# EasyEDA Pro project ESD_System.eprj, board PCB5
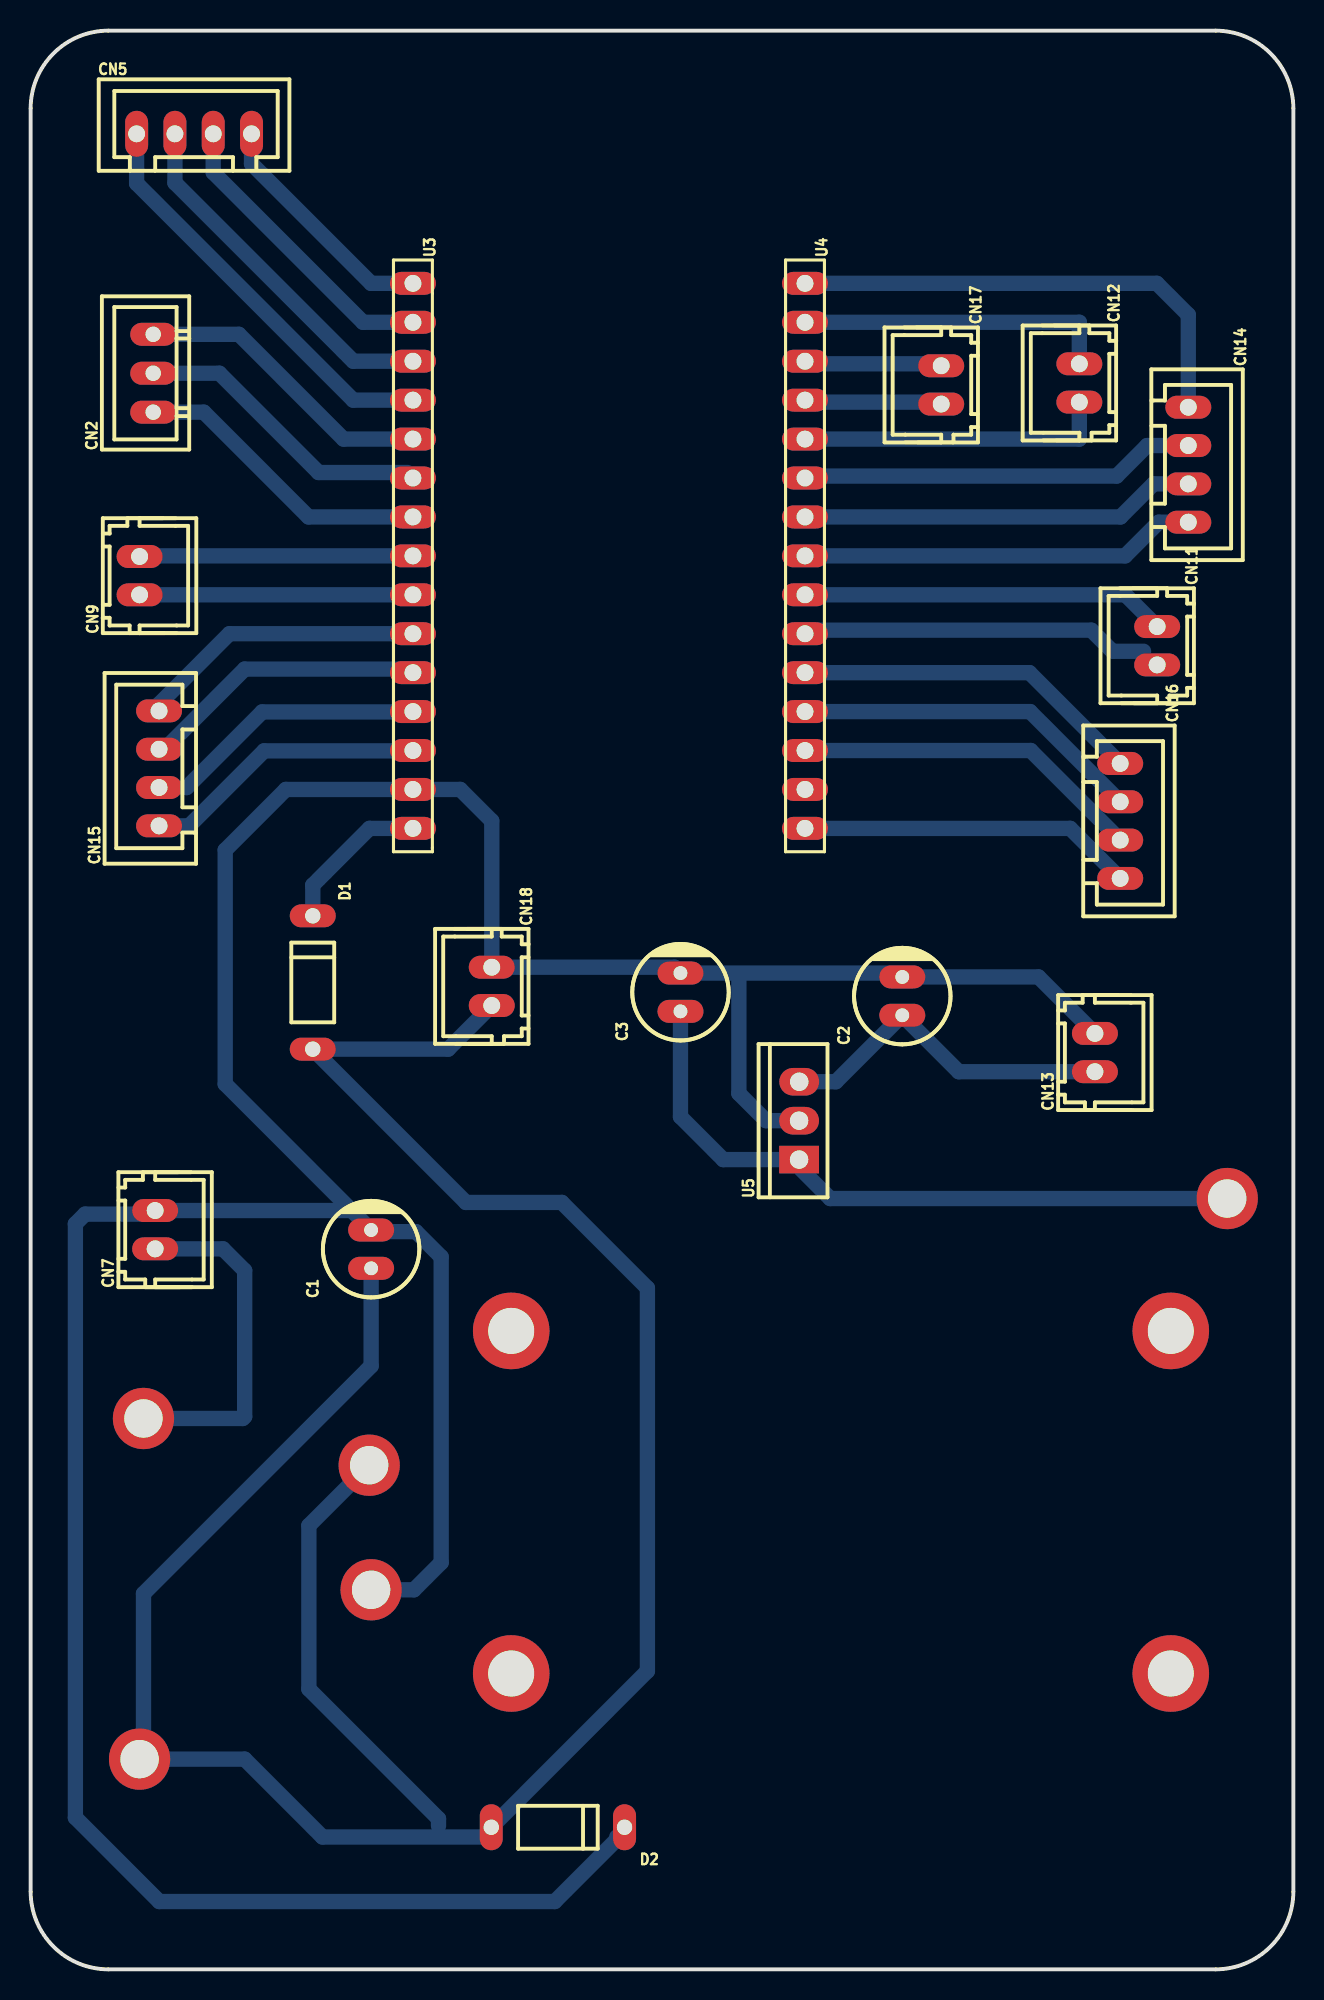
[diagram p4: board, top side]
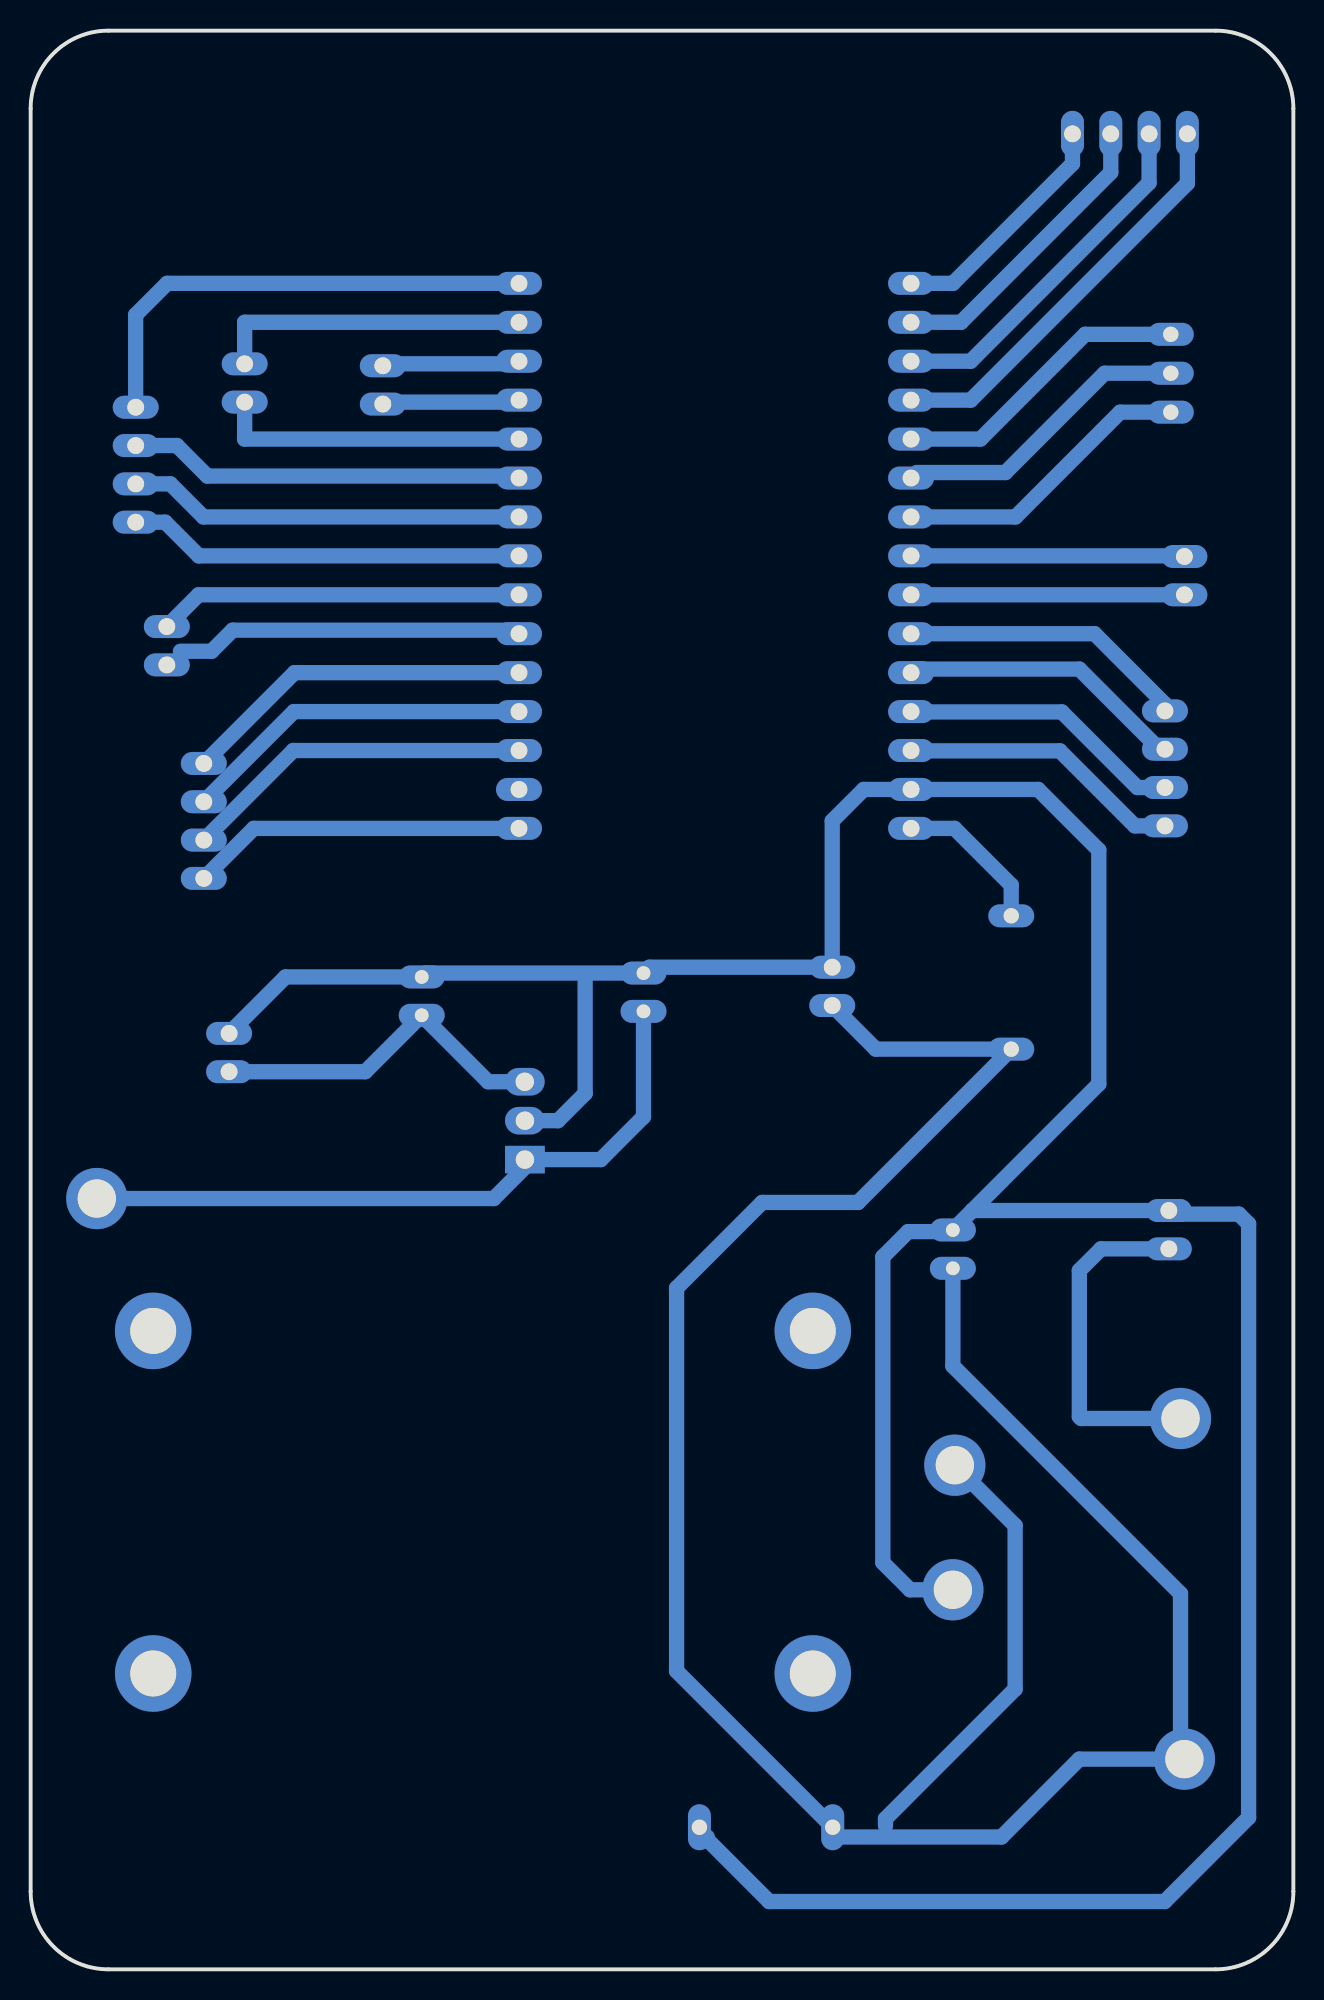
[diagram p5: board, bottom side, seen from below]

Outline 82.42 x 126.49 mm; copper layers: Top Layer, Bottom Layer. Coordinates in mm from the lower left corner of the outline.
Outline path: 0,121.41 0,5.08 arc(1.49,1.49) 5.08,0 77.34,0 arc(80.94,1.49) 82.42,5.08 82.42,121.41 arc(80.94,125) 77.34,126.49 5.08,126.49 arc(1.49,125) 0,121.41
Stack: Top Layer 0.035mm / Dielectric1 1.51mm FR4 er 4.5 / Bottom Layer 0.035mm

## Design rules (mm)
template: JLCPCB Capability(Two Layers Board)
spacing copperThickness1oz (default): track to track 0.102, other pairs 0.152 to 0.3
spacing copperThickness2oz: track to track 0.203, other pairs 0.152 to 0.3
track width copperThickness1oz (default): min 0.127, default 0.254, max 2.54
track width copperThickness2oz: min 0.203, default 0.254, max 2.54
differential pair differentialPair (default): width min 0.127, default 0.254, max 2.54; gap min 0.152, default 0.152
via viaSize (default): diameter min 0.5, default 0.61, max 10; hole min 0.3, default 0.305, max 6.3

## Placement (name value [footprint] x y rotation side)
C1  100uF  [CAP-TH_BD6.3-P2.50-D0.5-FD]  22.22 46.99 90 top
C2  100uF  [CAP-TH_BD6.3-P2.50-D0.5-FD]  56.9 63.5 90 top
C3  100uF  [CAP-TH_BD6.3-P2.50-D0.5-FD]  42.42 63.75 90 top
CN2  ZX-XH2.54-3PZZ  [CONN-TH_3P-P2.54_2501S-3P]  8 104.14 90 top
CN5  ZX-XH2.54-4PZZ  [CONN-TH_4P-P2.50_4PIN]  10.67 119.76 0 top
CN7  ZX-XH2.54-2PZZ  [CONN-TH_2P-P2.50_HX25003-2A]  8.13 48.26 90 top
CN9  ZX-XH2.54-2PZZ  [CONN-TH_2P-P2.50_HX25003-2A]  7.11 90.93 90 top
CN11  ZX-XH2.54-2PZZ  [CONN-TH_2P-P2.50_HX25003-2A]  73.53 86.36 270 top
CN12  ZX-XH2.54-2PZZ  [CONN-TH_2P-P2.50_HX25003-2A]  68.45 103.5 270 top
CN13  ZX-XH2.54-2PZZ  [CONN-TH_2P-P2.50_HX25003-2A]  69.47 59.82 90 top
CN14  ZX-XH2.54-4PZZ  [CONN-TH_4P-P2.50_4PIN]  75.56 98.17 270 top
CN15  ZX-XH2.54-4PZZ  [CONN-TH_4P-P2.50_4PIN]  8.38 78.36 90 top
CN16  ZX-XH2.54-4PZZ  [CONN-TH_4P-P2.50_4PIN]  71.12 74.93 270 top
CN17  ZX-XH2.54-2PZZ  [CONN-TH_2P-P2.50_HX25003-2A]  59.44 103.38 270 top
CN18  ZX-XH2.54-2PZZ  [CONN-TH_2P-P2.50_HX25003-2A]  30.1 64.14 270 top
D1  1N4001  [DO-41_BD2.4-L4.7-P8.70-D0.9-RD]  18.41 64.39 270 top
D2  1N4001  [DO-41_BD2.4-L4.7-P8.70-D0.9-RD]  34.42 9.27 180 top
NOREF  -  [Pad_e421]  3.94 3.81 270 top
NOREF#2  -  [Pad_e429]  77.22 122.68 270 top
NOREF#3  -  [Pad_e252]  7.37 35.94 0 top
NOREF#4  -  [Pad_e366]  74.42 41.66 0 top
NOREF#5  -  [Pad_e257]  7.11 13.72 0 top
NOREF#6  -  [Pad_e364]  74.42 19.3 0 top
NOREF#7  -  [Pad_e338]  22.22 24.77 0 top
NOREF#8  -  [Pad_e417]  77.85 3.81 270 top
NOREF#9  -  [Pad_e340]  78.11 50.29 0 top
NOREF#10  -  [Pad_e425]  22.1 122.56 270 top
NOREF#11  -  [Pad_e339]  22.1 32.89 0 top
NOREF#12  -  [Pad_e365]  31.37 41.66 0 top
NOREF#13  -  [Pad_e359]  31.37 19.3 0 top
U3  ZX-PM2.54-1-15PY  [HDR-TH_15P-P2.54-V-F]  24.95 92.22 270 top
U4  ZX-PM2.54-1-15PY  [HDR-TH_15P-P2.54-V-F]  50.55 92.22 270 top
U5  LM7809T  [TO-220-3_L10.0-W4.5-P2.54-L-1]  50.17 55.37 90 top

## Footprints (pads in the part's own frame, mm; a bottom-side part is the same pattern mirrored in y, then rotated)
CAP-TH_BD6.3-P2.50-D0.5-FD
  oval 1.5x3 hole 0.9: 1(-1.25,0) 2(1.25,0)
CONN-TH_2P-P2.50_HX25003-2A
  oval 1.5x3 hole 1.1: 1(-1.25,0) 2(1.25,0)
CONN-TH_3P-P2.54_2501S-3P
  oval 1.5x3 hole 1: 1(-2.54,0) 2(0,0) 3(2.54,0)
CONN-TH_4P-P2.50_4PIN
  oval 1.5x3 hole 1.1: 1(-3.75,0) 2(-1.25,0) 3(1.25,0) 4(3.75,0)
DO-41_BD2.4-L4.7-P8.70-D0.9-RD
  oval 1.5x3 hole 1: 1(-4.35,0) 2(4.35,0)
HDR-TH_15P-P2.54-V-F
  oval 1.5x3 hole 1.1: 1(-17.78,0) 2(-15.24,0) 3(-12.7,0) 4(-10.16,0) 5(-7.62,0) 6(-5.08,0) 7(-2.54,0) 8(0,0) 9(2.54,0) 10(5.08,0) 11(7.62,0) 12(10.16,0) 13(12.7,0) 14(15.24,0) 15(17.78,0)
Pad_e252
  round 4 hole 2.5: 1(0,0)
Pad_e257
  round 4 hole 2.5: 1(0,0)
Pad_e338
  round 4 hole 2.5: 1(0,0)
Pad_e339
  round 4 hole 2.5: 1(0,0)
Pad_e340
  round 4 hole 2.5: 1(0,0)
Pad_e359
  round 5 hole 3: 1(0,0)
Pad_e364
  round 5 hole 3: 1(0,0)
Pad_e365
  round 5 hole 3: 2(0,0)
Pad_e366
  round 5 hole 3: 3(0,0)
Pad_e417
  round 0.003 hole 3: 1(0,0)
Pad_e421
  round 0.003 hole 3: 1(0,0)
Pad_e425
  round 0.003 hole 3: 1(0,0)
Pad_e429
  round 0.003 hole 3: 1(0,0)
TO-220-3_L10.0-W4.5-P2.54-L-1
  rect 1.8x2.6 hole 1.2: 1(-2.54,0.005)
  oval 1.8x2.6 hole 1.2: 2(0,0.005) 3(2.54,-0.005)

## Nets
As in the schematic, except:
$1N1165: CN16.4 NOREF.1 NOREF#2.1 NOREF#8.1 NOREF#10.1 U4.15
$1N1236: C1.2 C2.2 C3.2 CN7.2 CN13.2 CN18.1 D2.1 NOREF#7.1 U3.14 U5.2
$1N1282: C1.1 CN18.2 D1.2 D2.2 NOREF#5.1
$1N1289: CN7.1 NOREF#3.1 NOREF#11.1
$1N1297: C3.1 NOREF#9.1 U5.1

Pads without a net: NOREF#4 3; NOREF#6 1; NOREF#12 2; NOREF#13 1; U4 14

## Routing (per net, layer and track width the routed paths; a pad name or vN(x,y) marks a point on that pad's centre or on a via; arc(x,y) is an arc through that point)
$1N1149: length 9.8
  Top Layer w0.254: 50.67,102.25 U4.4
  Bottom Layer w1: 50.67,102.25 59.79,102.25 59.79,102.13 CN17.2
$1N1153: length 23
  Bottom Layer w1: CN16.2 65.24,82.06 U4.12
$1N1159: length 23
  Bottom Layer w1: U4.13 65.28,79.52 CN16.3
$1N1165: length 21.9
  Bottom Layer w1: U4.15 67.86,74.44 CN16.4
$1N1171: length 23
  Bottom Layer w1: U4.11 65.2,84.6 CN16.1
$1N1177: length 20.4
  Bottom Layer w1: 68.45,102.36 68.45,99.84 U4.5
$1N1182: length 9
  Top Layer w0.254: 50.71,104.75 U4.3
  Bottom Layer w1: CN17.1 59.31,104.75 50.71,104.75
$1N1186: length 31.9
  Bottom Layer w1: U4.1 73.51,110 75.56,107.95 CN14.1
$1N1192: length 20.6
  Bottom Layer w1: U4.2 68.45,107.46 68.45,104.75
$1N1197: length 23.8
  Bottom Layer w1: CN11.1 71.46,89.68 U4.9
$1N1201: length 22.8
  Bottom Layer w1: U4.10 50.78,87.38 69.23,87.38 70.61,86 72.64,86
$1N1205: length 25.9
  Bottom Layer w1: CN14.3 73.3,96.92 71.14,94.76 U4.7
$1N1209: length 25.9
  Bottom Layer w1: CN14.4 73.64,94.42 71.44,92.22 U4.8
$1N1213: length 25.9
  Bottom Layer w1: CN14.2 72.88,99.42 70.89,97.43 50.67,97.43 U4.6
$1N1217: length 18.6
  Bottom Layer w1: U3.12 24.93,82.04 15.11,82.04 10.18,77.11 CN15.2
$1N1221: length 19.8
  Bottom Layer w1: CN2.1 11.3,101.6 18.14,94.76 U3.7
$1N1224: length 18.9
  Bottom Layer w1: CN15.4 8.38,82.55 12.98,87.14 U3.10
$1N1228: length 18.8
  Bottom Layer w1: CN15.3 8.74,79.61 13.97,84.84 24.72,84.84 U3.11
$1N1232: length 18.6
  Bottom Layer w1: U3.13 24.93,79.5 15.24,79.5 10.35,74.61 CN15.1
$1N1236: length 238.6
  Bottom Layer w1: 38.26,8.64 38.26,8.47 34.21,4.42 8.4,4.42 2.92,9.9 2.92,48.64 3.56,49.28 7.89,49.28 CN7.2 20.95,49.51 ; 22.33,48.13 25.15,48.13 26.8,46.48 26.8,26.54 25.02,24.77 NOREF#7.1 ; 20.95,49.51 12.7,57.77 12.7,73.03 16.66,76.98 U3.14 28.05,76.98 30.1,74.93 CN18.1 42.04,65.39 C3.2 56.64,65 C2.2 65.79,64.75 CN13.2 ; 20.95,49.51 C1.2 ; 46.23,64.77 46.23,57.15 48.01,55.37 U5.2
$1N1255: length 19.8
  Bottom Layer w1: U3.5 20.42,99.84 13.59,106.68 CN2.3
$1N1258: length 19.8
  Top Layer w0.254: U3.6 24.59,97.66
  Bottom Layer w1: 24.59,97.66 18.8,97.66 12.32,104.14 CN2.2
$1N1261: length 27.1
  Bottom Layer w1: U3.4 21.06,102.38 6.92,116.53 CN5.1
$1N1264: length 15.7
  Bottom Layer w1: CN5.4 14.42,117.81 22.22,110 U3.1
$1N1267: length 19.6
  Bottom Layer w1: U3.2 21.69,107.46 11.92,117.24 CN5.3
$1N1270: length 23.6
  Bottom Layer w1: CN5.2 9.42,116.57 21.06,104.92 U3.3
$1N1273: length 17.9
  Bottom Layer w1: CN9.2 7.15,92.22 U3.8
$1N1276: length 17.8
  Bottom Layer w1: U3.9 7.11,89.68
$1N1282: length 143.4
  Bottom Layer w1: CN18.2 27.25,60.04 D1.2 28.42,50.04 34.67,50.04 40.26,44.45 40.26,19.46 D2.2 ; C1.1 22.22,39.37 7.37,24.51 7.37,13.97 NOREF#5.1 13.97,13.72 19.05,8.64 29.56,8.64
$1N1289: length 51.3
  Bottom Layer w1: 26.62,9.37 26.62,9.83 18.16,18.29 18.16,28.96 NOREF#11.1 ; CN7.1 12.55,47.01 13.97,45.59 13.97,36.07 13.84,35.94 NOREF#3.1
$1N1294: length 10.1
  Bottom Layer w1: U3.15 22.12,74.44 18.41,70.74 18.41,68.74
$1N1297: length 44.8
  Bottom Layer w1: C3.1 42.42,55.63 45.21,52.83 49.65,52.83 52.19,50.29 NOREF#9.1
$1N1300: length 22.6
  Bottom Layer w1: CN13.1 60.58,58.57 C2.1 52.56,57.91 U5.3
